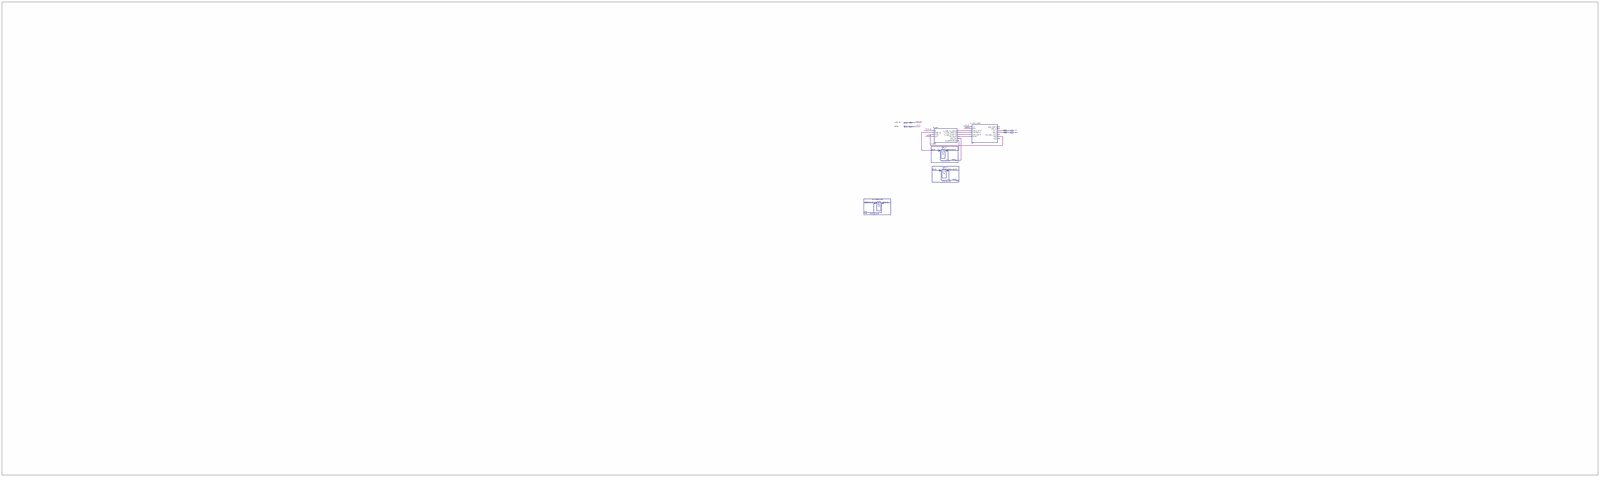
[diagram p0: schematic sheet, whole]
// Quartus schematic config_output.bdf as structural Verilog: 5 symbols, 4 pins
module config_output (
  input  CLOCK_50,
  input  [1:1] KEY,
  inout  SCL,
  inout  SDA
);

  wire i2c_busy, inst4_data_clk, inst4_req_trans;
  wire [5:0] inst4_rd_address;
  wire [7:0] inst4_o_addr_w_rw, inst4_o_data_write, inst4_o_sub_addr, inst_q;

  rom_scrambler_config inst6 ();  // open: address, clock, q
  cfg_reader inst4 (
    .clk(CLOCK_50), .data(inst_q), .i2c_busy(i2c_busy), .reset_n(KEY[1]), .o_addr_w_rw(inst4_o_addr_w_rw),
    .o_sub_addr(inst4_o_sub_addr), .o_data_write(inst4_o_data_write), .req_trans(inst4_req_trans),
    .data_clk(inst4_data_clk), .rd_address(inst4_rd_address));
  rom_1 inst (.address(inst4_rd_address), .clock(inst4_data_clk), .q(inst_q));
  rom_1 inst1 ();  // open: address, clock, q
  i2c_master_controller inst3 (
    .i_clk(CLOCK_50), .reset_n(KEY[1]), .i_addr_w_rw(inst4_o_addr_w_rw), .i_sub_addr(inst4_o_sub_addr),
    .i_data_write(inst4_o_data_write), .req_trans(inst4_req_trans), .busy(i2c_busy), .scl_o(SCL), .sda_o(SDA));  // open: data_out, valid_out, req_data_chunk, nack

  // Other names for the same wires on the sheet: RESET = KEY[1]
endmodule
